# EasyEDA Pro project devboard.epro, schematic Devel Cartridge
Create Date: 2023-12-26; Page Name: UART; Project Name: RCKid2; Schematic Name: Schematic1; Update Date: 2023-12-26; Company: EasyEDA.com; Drawed: EasyEDAPro; Page Size: A4; Part Number: JLCPCB-002; Reviewed: EasyEDAPro; Version: V0.1
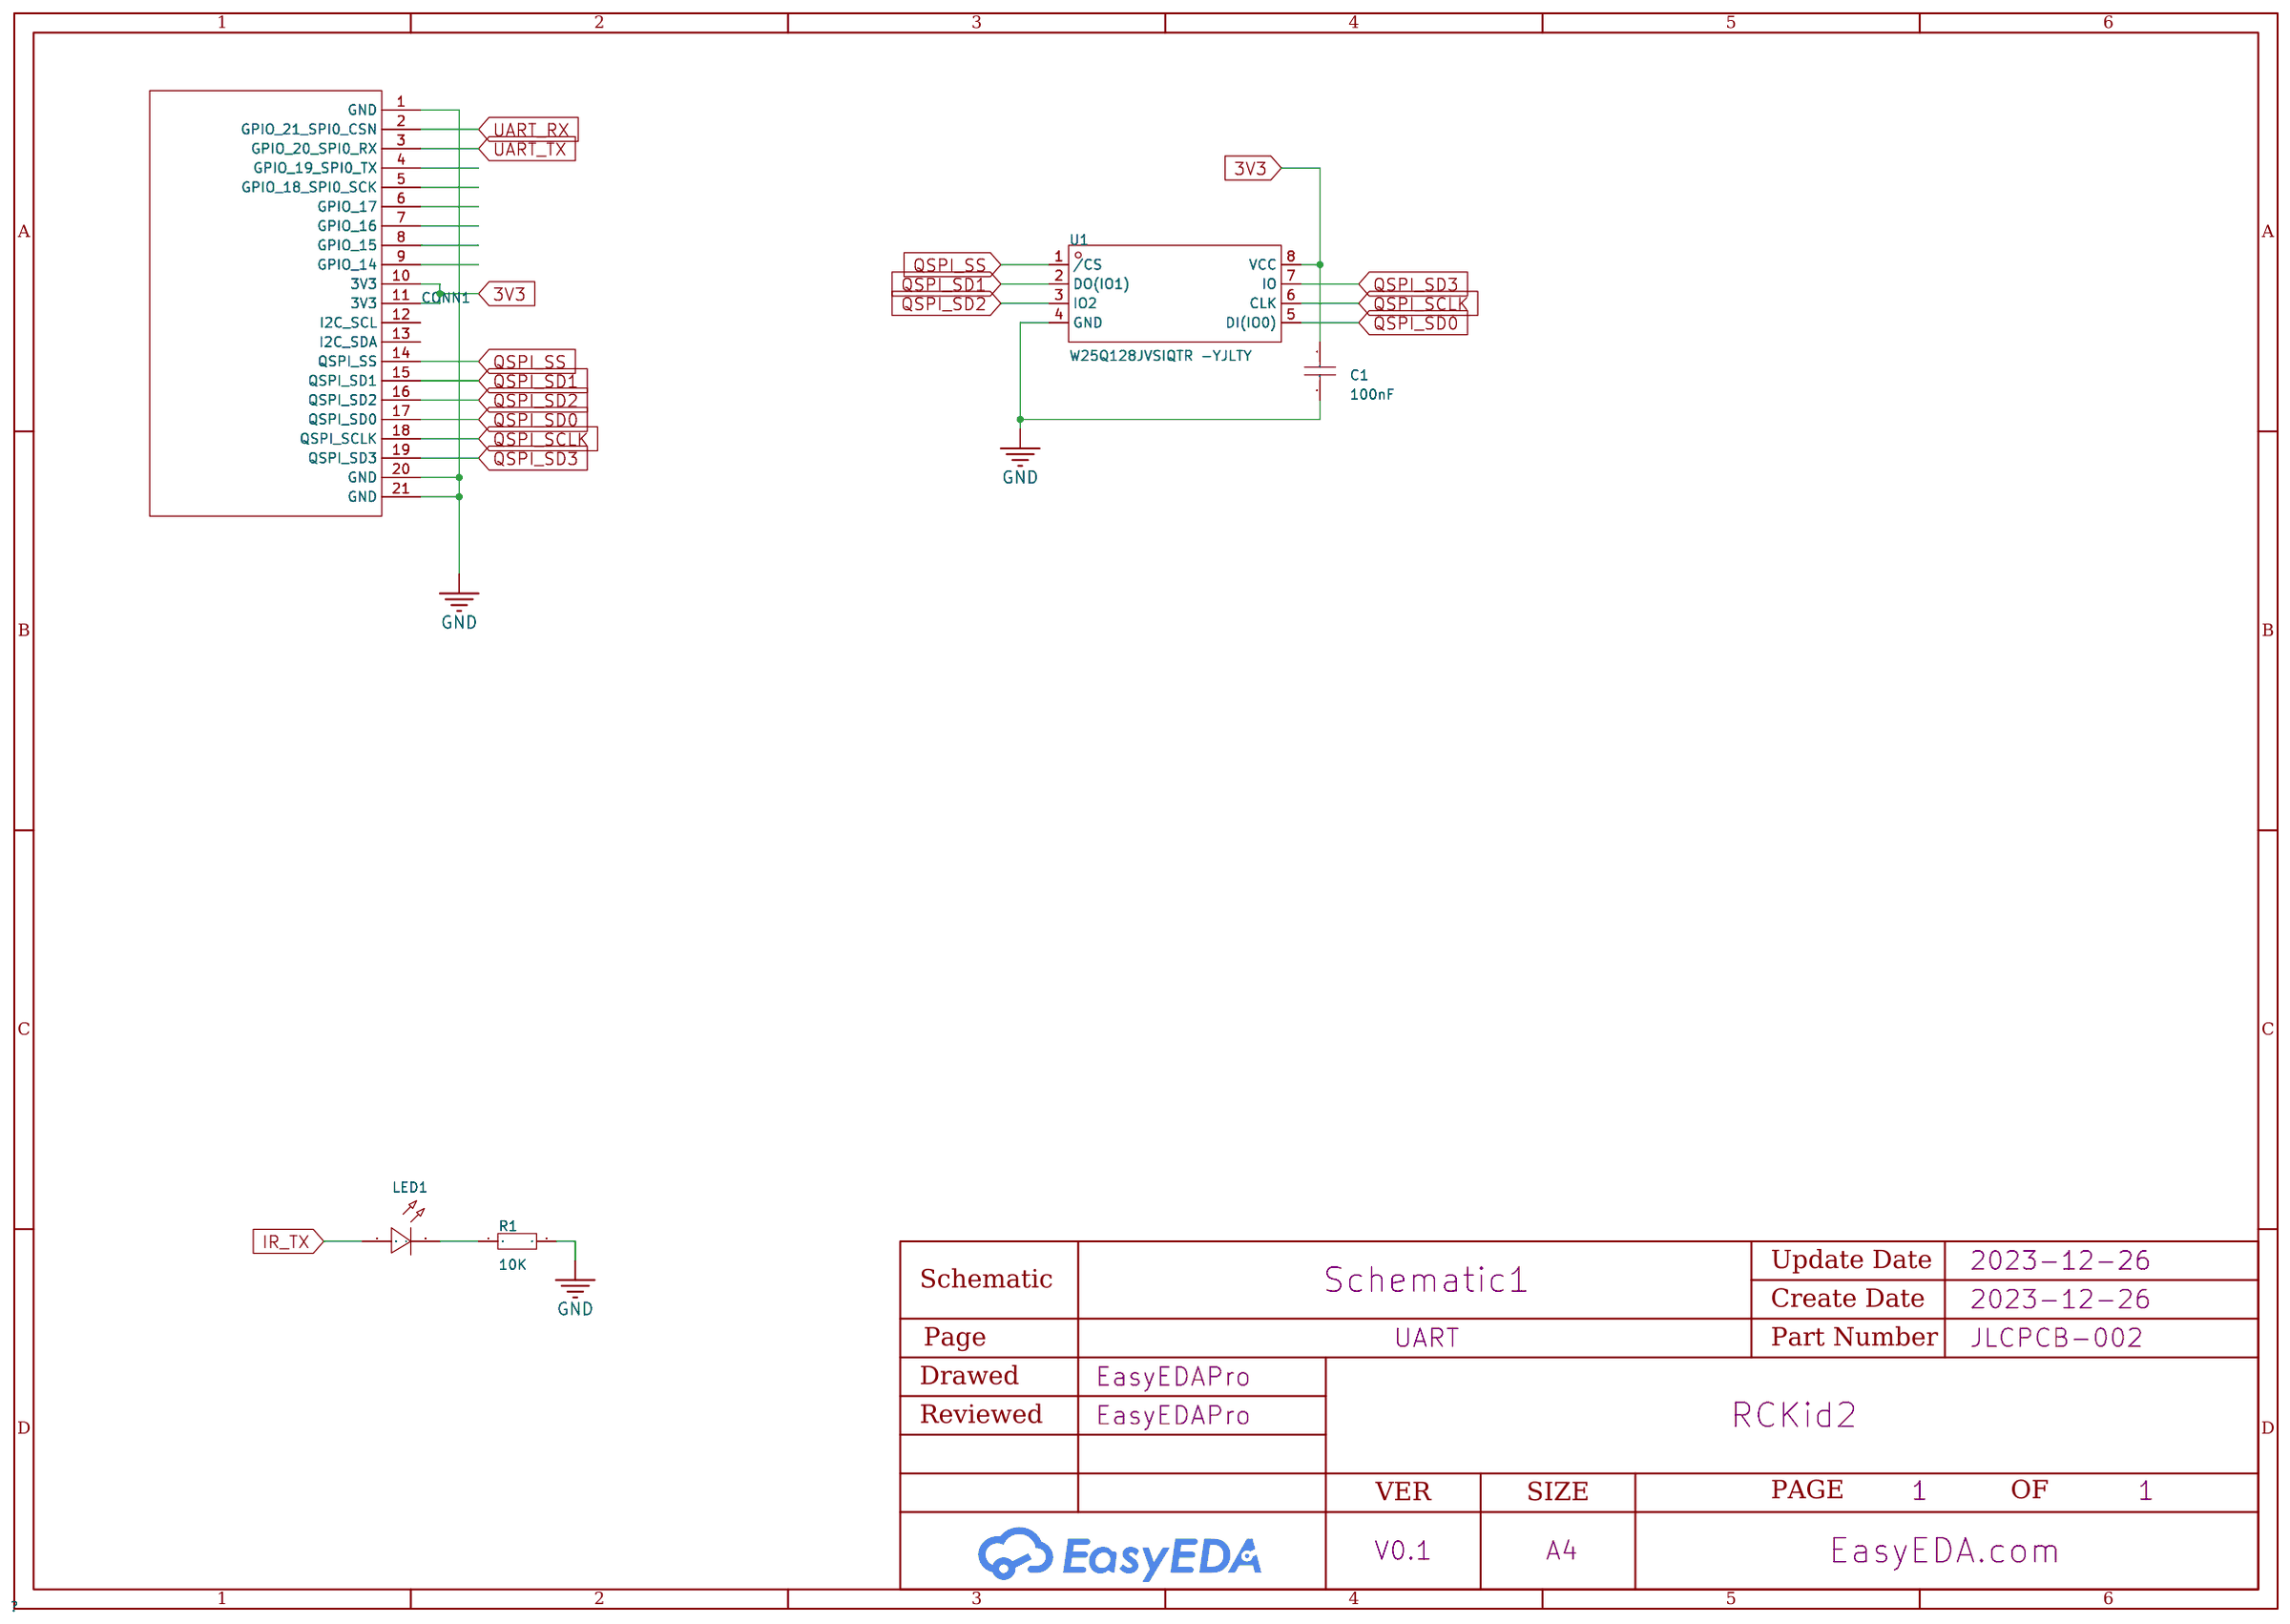
[diagram p9: schematic sheet]

## Parts
C1  100nF  [C0805]
CONN1  -  [RCKid Cartridge Pins]
LED1  -  [LED-TH_BD3.0-P2.54-FD]
R1  10K  [R0805]
U1  W25Q128JVSIQTR -YJLTY  [SOIC-8_L5.3-W5.3-P1.27-LS8.0-BL]

## Library data of the parts
C1 = CL21B104KCFNNNE: Capacitance: Tolerance:±10% Tolerance:±10% Voltage Rated: Temperature Coefficient:; LCSC Part Name: 100nF ±10% 100V; Supplier Part: C28233; Manufacturer: SAMSUNG(三星); Supplier Footprint: 0805; JLCPCB Part Class: Basic Part; Datasheet: https://atta.szlcsc.com/upload/public/pdf/source/20160103/1457707716102.pdf; Supplier: LCSC; Tolerance: ±10%
CONN1 = RCKid2 Cartridge Connector
LED1 = LED_TH-R_3mm: Supplier Footprint: Through
R1 = Res_0805: Supplier Footprint: 0805
U1 = W25Q128JVSIQTR -YJLTY: LCSC Part Name: 串行闪存; Supplier Part: C2921483; Manufacturer: WINBOND(华邦); Supplier Footprint: SOIC-8-208mil; JLCPCB Part Class: Extended Part; Datasheet: 2021-11-15/642689F/b4c28fe9be624f43904f2fc1db378149/STM32F429IGT6.pdf; Supplier: LCSC

## Nets
3V3: C1.2 CONN1.10(3V3) CONN1.11(3V3) U1.8(VCC)
GND: C1.1 CONN1.1(GND) CONN1.20(GND) CONN1.21(GND) R1.2 U1.4(GND)
IR_TX: LED1.1(C)
QSPI_SCLK: CONN1.18(QSPI_SCLK) U1.6(CLK)
QSPI_SD0: CONN1.17(QSPI_SD0) U1.5(DI(IO0))
QSPI_SD1: CONN1.15(QSPI_SD1) U1.2(DO(IO1))
QSPI_SD2: CONN1.16(QSPI_SD2) U1.3(IO2)
QSPI_SD3: CONN1.19(QSPI_SD3) U1.7(IO)
QSPI_SS: CONN1.14(QSPI_SS) U1.1(/CS)
UART_RX: CONN1.2(GPIO_21_SPI0_CSN)
UART_TX: CONN1.3(GPIO_20_SPI0_RX)
Net-(LED1-2): LED1.2(A) R1.1

Not connected (* = marked no-connect by the designer): CONN1 4(GPIO_19_SPI0_TX) 5(GPIO_18_SPI0_SCK) 6(GPIO_17) 7(GPIO_16) 8(GPIO_15) 9(GPIO_14) 12(I2C_SCL) 13(I2C_SDA)
